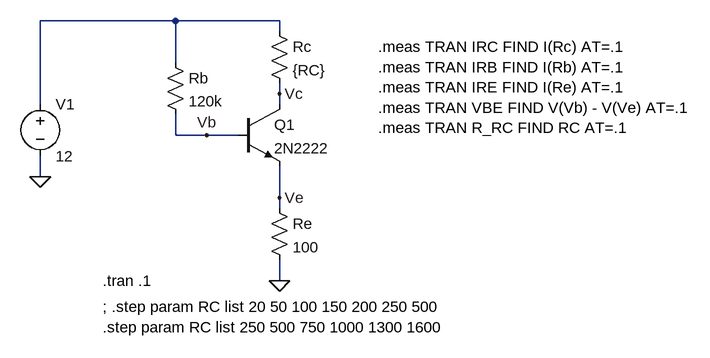
[diagram p0: schematic transistorPolarisation1.asc]
transistorPolarisation1.asc, the LTspice schematic file:
Version 4.1
SHEET 1 1108 680
WIRE 240 -96 32 -96
WIRE 400 -96 240 -96
WIRE 400 -80 400 -96
WIRE 240 -32 240 -96
WIRE 400 16 400 0
WIRE 32 32 32 -96
WIRE 400 32 400 16
WIRE 240 80 240 48
WIRE 288 80 240 80
WIRE 336 80 288 80
WIRE 32 144 32 112
WIRE 400 176 400 128
WIRE 400 192 400 176
WIRE 400 304 400 272
FLAG 400 304 0
FLAG 32 144 0
FLAG 400 176 Ve
FLAG 400 16 Vc
FLAG 288 80 Vb
SYMBOL voltage 32 16 R0
WINDOW 123 0 0 Left 0
WINDOW 39 0 0 Left 0
SYMATTR InstName V1
SYMATTR Value 12
SYMBOL npn 336 32 R0
SYMATTR InstName Q1
SYMATTR Value 2N2222
SYMBOL res 224 -48 R0
SYMATTR InstName Rb
SYMATTR Value 120k
SYMBOL res 384 -96 R0
SYMATTR InstName Rc
SYMATTR Value {RC}
SYMBOL res 384 176 R0
SYMATTR InstName Re
SYMATTR Value 100
TEXT 128 304 Left 2 !.tran .1
TEXT 128 344 Left 2 !; .step param RC list 20 50 100 150 200 250 500\n.step param RC list 250 500 750 1000 1300 1600
TEXT 552 -56 Left 2 !.meas TRAN IRC FIND I(Rc) AT=.1\n.meas TRAN IRB FIND I(Rb) AT=.1\n.meas TRAN IRE FIND I(Re) AT=.1\n.meas TRAN VBE FIND V(Vb) - V(Ve) AT=.1\n.meas TRAN R_RC FIND RC AT=.1

The netlist it stands for:
* transistorPolarisation1.asc
V1 N001 0 12
Q1 Vc Vb Ve 0 2N2222
Rb N001 Vb 120k
Rc N001 Vc {RC}
Re Ve 0 100
.model NPN NPN
.model PNP PNP
.lib standard.bjt
.tran .1
; .step param RC list 20 50 100 150 200 250 500
.step param RC list 250 500 750 1000 1300 1600
.meas TRAN IRC FIND I(Rc) AT=.1
.meas TRAN IRB FIND I(Rb) AT=.1
.meas TRAN IRE FIND I(Re) AT=.1
.meas TRAN VBE FIND V(Vb) - V(Ve) AT=.1
.meas TRAN R_RC FIND RC AT=.1
.backanno
.end